# EAGLE schematic seq__control_pad_02 (EAGLE 7.7.0)

## Sheet 1 of 2
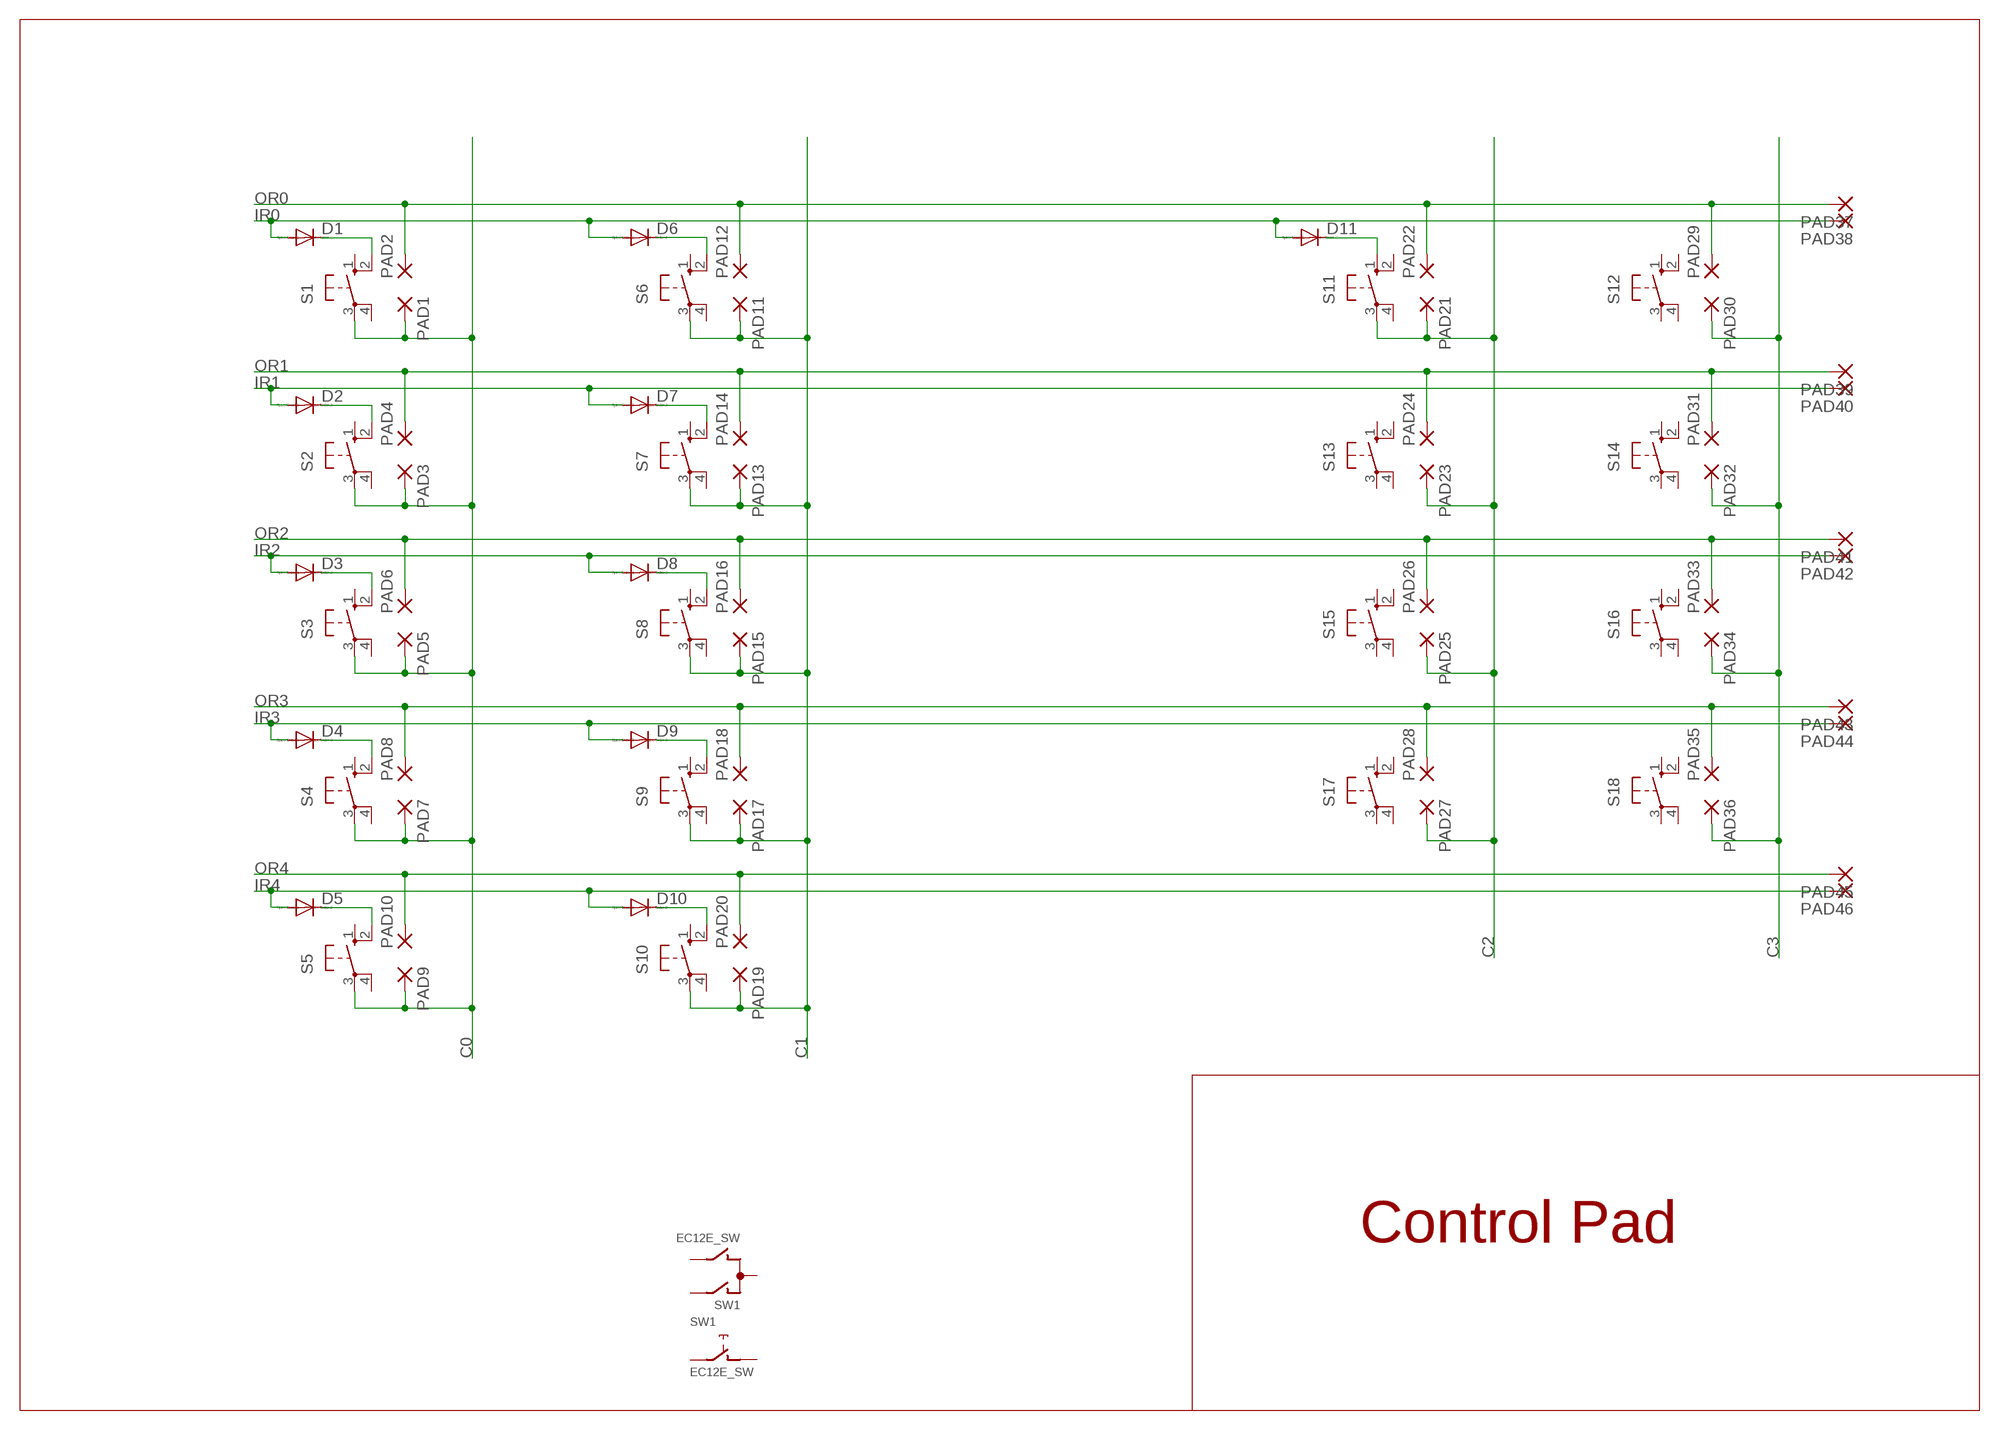
[diagram p0: schematic, sheet 1]

### Parts
D1  DIODE-MINIMELF  [MINIMELF]
D2  DIODE-MINIMELF  [MINIMELF]
D3  DIODE-MINIMELF  [MINIMELF]
D4  DIODE-MINIMELF  [MINIMELF]
D5  DIODE-MINIMELF  [MINIMELF]
D6  DIODE-MINIMELF  [MINIMELF]
D7  DIODE-MINIMELF  [MINIMELF]
D8  DIODE-MINIMELF  [MINIMELF]
D9  DIODE-MINIMELF  [MINIMELF]
D10  DIODE-MINIMELF  [MINIMELF]
D11  DIODE-MINIMELF  [MINIMELF]
PAD1  1,6/0,8  [1,6/0,8]
PAD2  1,6/0,8  [1,6/0,8]
PAD3  1,6/0,8  [1,6/0,8]
PAD4  1,6/0,8  [1,6/0,8]
PAD5  1,6/0,8  [1,6/0,8]
PAD6  1,6/0,8  [1,6/0,8]
PAD7  1,6/0,8  [1,6/0,8]
PAD8  1,6/0,8  [1,6/0,8]
PAD9  1,6/0,8  [1,6/0,8]
PAD10  1,6/0,8  [1,6/0,8]
PAD11  1,6/0,8  [1,6/0,8]
PAD12  1,6/0,8  [1,6/0,8]
PAD13  1,6/0,8  [1,6/0,8]
PAD14  1,6/0,8  [1,6/0,8]
PAD15  1,6/0,8  [1,6/0,8]
PAD16  1,6/0,8  [1,6/0,8]
PAD17  1,6/0,8  [1,6/0,8]
PAD18  1,6/0,8  [1,6/0,8]
PAD19  1,6/0,8  [1,6/0,8]
PAD20  1,6/0,8  [1,6/0,8]
PAD21  1,6/0,8  [1,6/0,8]
PAD22  1,6/0,8  [1,6/0,8]
PAD23  1,6/0,8  [1,6/0,8]
PAD24  1,6/0,8  [1,6/0,8]
PAD25  1,6/0,8  [1,6/0,8]
PAD26  1,6/0,8  [1,6/0,8]
PAD27  1,6/0,8  [1,6/0,8]
PAD28  1,6/0,8  [1,6/0,8]
PAD29  1,6/0,8  [1,6/0,8]
PAD30  1,6/0,8  [1,6/0,8]
PAD31  1,6/0,8  [1,6/0,8]
PAD32  1,6/0,8  [1,6/0,8]
PAD33  1,6/0,8  [1,6/0,8]
PAD34  1,6/0,8  [1,6/0,8]
PAD35  1,6/0,8  [1,6/0,8]
PAD36  1,6/0,8  [1,6/0,8]
PAD37  1,6/0,8  [1,6/0,8]
PAD38  1,6/0,8  [1,6/0,8]
PAD39  1,6/0,8  [1,6/0,8]
PAD40  1,6/0,8  [1,6/0,8]
PAD41  1,6/0,8  [1,6/0,8]
PAD42  1,6/0,8  [1,6/0,8]
PAD43  1,6/0,8  [1,6/0,8]
PAD44  1,6/0,8  [1,6/0,8]
PAD45  1,6/0,8  [1,6/0,8]
PAD46  1,6/0,8  [1,6/0,8]
S1  40-XX  [B3F-40XX]
S2  40-XX  [B3F-40XX]
S3  40-XX  [B3F-40XX]
S4  40-XX  [B3F-40XX]
S5  40-XX  [B3F-40XX]
S6  40-XX  [B3F-40XX]
S7  40-XX  [B3F-40XX]
S8  40-XX  [B3F-40XX]
S9  40-XX  [B3F-40XX]
S10  40-XX  [B3F-40XX]
S11  40-XX  [B3F-40XX]
S12  40-XX  [B3F-40XX]
S13  40-XX  [B3F-40XX]
S14  40-XX  [B3F-40XX]
S15  40-XX  [B3F-40XX]
S16  40-XX  [B3F-40XX]
S17  40-XX  [B3F-40XX]
S18  40-XX  [B3F-40XX]
SW1  EC12E_SW  [ALPS_EC12E_SW]

### Nets
C0: PAD1.1(P) PAD3.1(P) PAD5.1(P) PAD7.1(P) PAD9.1(P) S1.3(P) S2.3(P) S3.3(P) S4.3(P) S5.3(P) ; also sheet 2
C1: PAD11.1(P) PAD13.1(P) PAD15.1(P) PAD17.1(P) PAD19.1(P) S6.3(P) S7.3(P) S8.3(P) S9.3(P) S10.3(P)
C2: PAD21.1(P) PAD23.1(P) PAD25.1(P) PAD27.1(P) S11.3(P)
C3: PAD30.1(P) PAD32.1(P) PAD34.1(P) PAD36.1(P)
IR0: D1.A D6.A D11.A PAD38.1(P) ; also sheet 2
IR1: D2.A D7.A PAD40.1(P) ; also sheet 2
IR2: D3.A D8.A PAD42.1(P) ; also sheet 2
IR3: D4.A D9.A PAD44.1(P) ; also sheet 2
IR4: D5.A D10.A PAD46.1(P) ; also sheet 2
N$5: D3.C S3.2(S1)
N$10: D1.C S1.2(S1)
N$11: D2.C S2.2(S1)
N$12: D5.C S5.2(S1)
N$13: D4.C S4.2(S1)
N$14: D6.C S6.2(S1)
N$15: D7.C S7.2(S1)
N$16: D8.C S8.2(S1)
N$17: D9.C S9.2(S1)
N$18: D10.C S10.2(S1)
N$19: D11.C S11.1(S)
OR0: PAD2.1(P) PAD12.1(P) PAD22.1(P) PAD29.1(P) PAD37.1(P) ; also sheet 2
OR1: PAD4.1(P) PAD14.1(P) PAD24.1(P) PAD31.1(P) PAD39.1(P) ; also sheet 2
OR2: PAD6.1(P) PAD16.1(P) PAD26.1(P) PAD33.1(P) PAD41.1(P) ; also sheet 2
OR3: PAD8.1(P) PAD18.1(P) PAD28.1(P) PAD35.1(P) PAD43.1(P) ; also sheet 2
OR4: PAD10.1(P) PAD20.1(P) PAD45.1(P) ; also sheet 2
Unconnected: S1.1(S) S1.4(P1) S2.1(S) S2.4(P1) S3.1(S) S3.4(P1) S4.1(S) S4.4(P1) S5.1(S) S5.4(P1) S6.1(S) S6.4(P1) S7.1(S) S7.4(P1) S8.1(S) S8.4(P1) S9.1(S) S9.4(P1) S10.1(S) S10.4(P1) S11.2(S1) S11.4(P1) S12.1(S) S12.2(S1) S12.3(P) S12.4(P1) S13.1(S) S13.2(S1) S13.3(P) S13.4(P1) S14.1(S) S14.2(S1) S14.3(P) S14.4(P1) S15.1(S) S15.2(S1) S15.3(P) S15.4(P1) S16.1(S) S16.2(S1) S16.3(P) S16.4(P1) S17.1(S) S17.2(S1) S17.3(P) S17.4(P1) S18.1(S) S18.2(S1) S18.3(P) S18.4(P1) SW1.A SW1.B SW1.C SW1.D SW1.E SW1.GND1(G) SW1.GND2(G)

### Notes on the sheet
- Control Pad

## Sheet 2 of 2
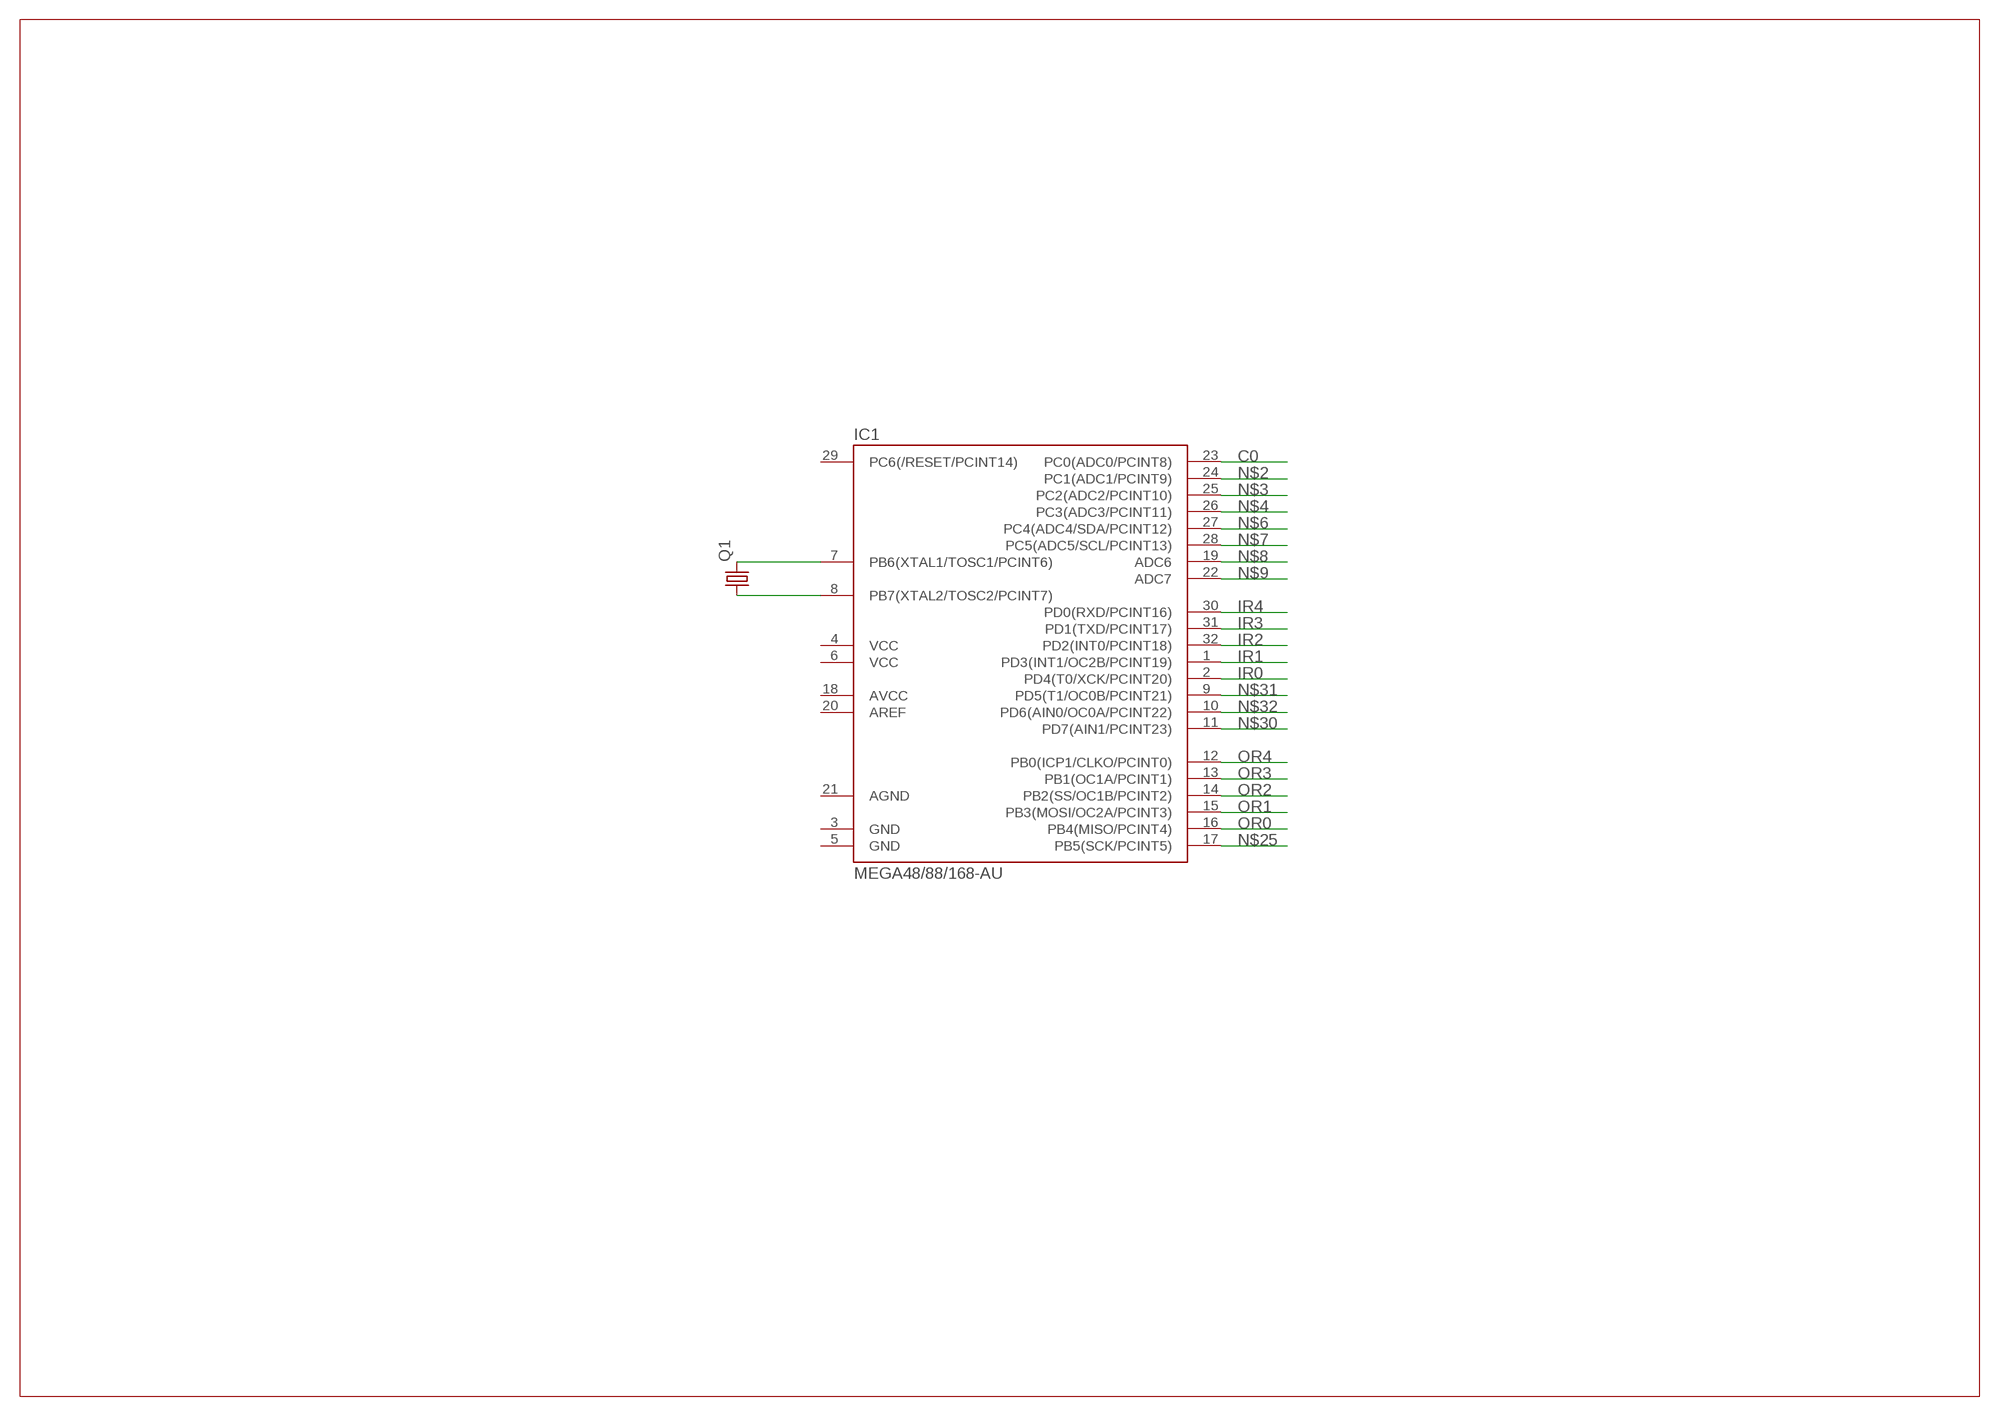
[diagram p1: schematic, sheet 2]

### Parts
IC1  MEGA48/88/168-AU  [TQFP32-08]
Q1  CRYSTALHC49S  [HC49/S]

### Nets
C0: IC1.23(PC0(ADC0/PCINT8)) ; also sheet 1
IR0: IC1.2(PD4(T0/XCK/PCINT20)) ; also sheet 1
IR1: IC1.1(PD3(INT1/OC2B/PCINT19)) ; also sheet 1
IR2: IC1.32(PD2(INT0/PCINT18)) ; also sheet 1
IR3: IC1.31(PD1(TXD/PCINT17)) ; also sheet 1
IR4: IC1.30(PD0(RXD/PCINT16)) ; also sheet 1
N$2: IC1.24(PC1(ADC1/PCINT9))
N$3: IC1.25(PC2(ADC2/PCINT10))
N$4: IC1.26(PC3(ADC3/PCINT11))
N$6: IC1.27(PC4(ADC4/SDA/PCINT12))
N$7: IC1.28(PC5(ADC5/SCL/PCINT13))
N$8: IC1.19(ADC6)
N$9: IC1.22(ADC7)
N$25: IC1.17(PB5(SCK/PCINT5))
N$30: IC1.11(PD7(AIN1/PCINT23))
N$31: IC1.9(PD5(T1/OC0B/PCINT21))
N$32: IC1.10(PD6(AIN0/OC0A/PCINT22))
OR0: IC1.16(PB4(MISO/PCINT4)) ; also sheet 1
OR1: IC1.15(PB3(MOSI/OC2A/PCINT3)) ; also sheet 1
OR2: IC1.14(PB2(SS/OC1B/PCINT2)) ; also sheet 1
OR3: IC1.13(PB1(OC1A/PCINT1)) ; also sheet 1
OR4: IC1.12(PB0(ICP1/CLKO/PCINT0)) ; also sheet 1
XTAL1: IC1.7(PB6(XTAL1/TOSC1/PCINT6)) Q1.2
XTAL2: IC1.8(PB7(XTAL2/TOSC2/PCINT7)) Q1.1
Unconnected: IC1.18(AVCC) IC1.20(AREF) IC1.29(PC6(/RESET/PCINT14))

## Power pins joined to a net without a drawn wire
AGND: IC1.21(AGND)
GND: IC1.3(GND) IC1.5(GND)
VCC: IC1.4(VCC) IC1.6(VCC)

## Library data of the parts
D1-D11 = diode:DIODE-: DIODE
IC1 = avr-7:MEGA48/88/168
PAD1-PAD46 = wirepad:1,6/0,8: THROUGH-HOLE PAD
Q1 = crystal:CRYSTAL: CRYSTAL; OC_FARNELL: 1667008; OC_NEWARK: unknown
S1-S18 = switch-omron:40-XX: OMRON SWITCH; MF: OMRON COMPONENTS USA; MPN: B3F-4000; OC_FARNELL: 176434; OC_NEWARK: 36K3105
SW1 = switch-alps:EC12E_SW: ALPS rotary Encoder EC12E series with switch; MPN: EC12E2424407; OC_FARNELL: 1520813; OC_NEWARK: 74M1068